# Altium schematic sheet 02 POWER&LED.SchDoc
size A3
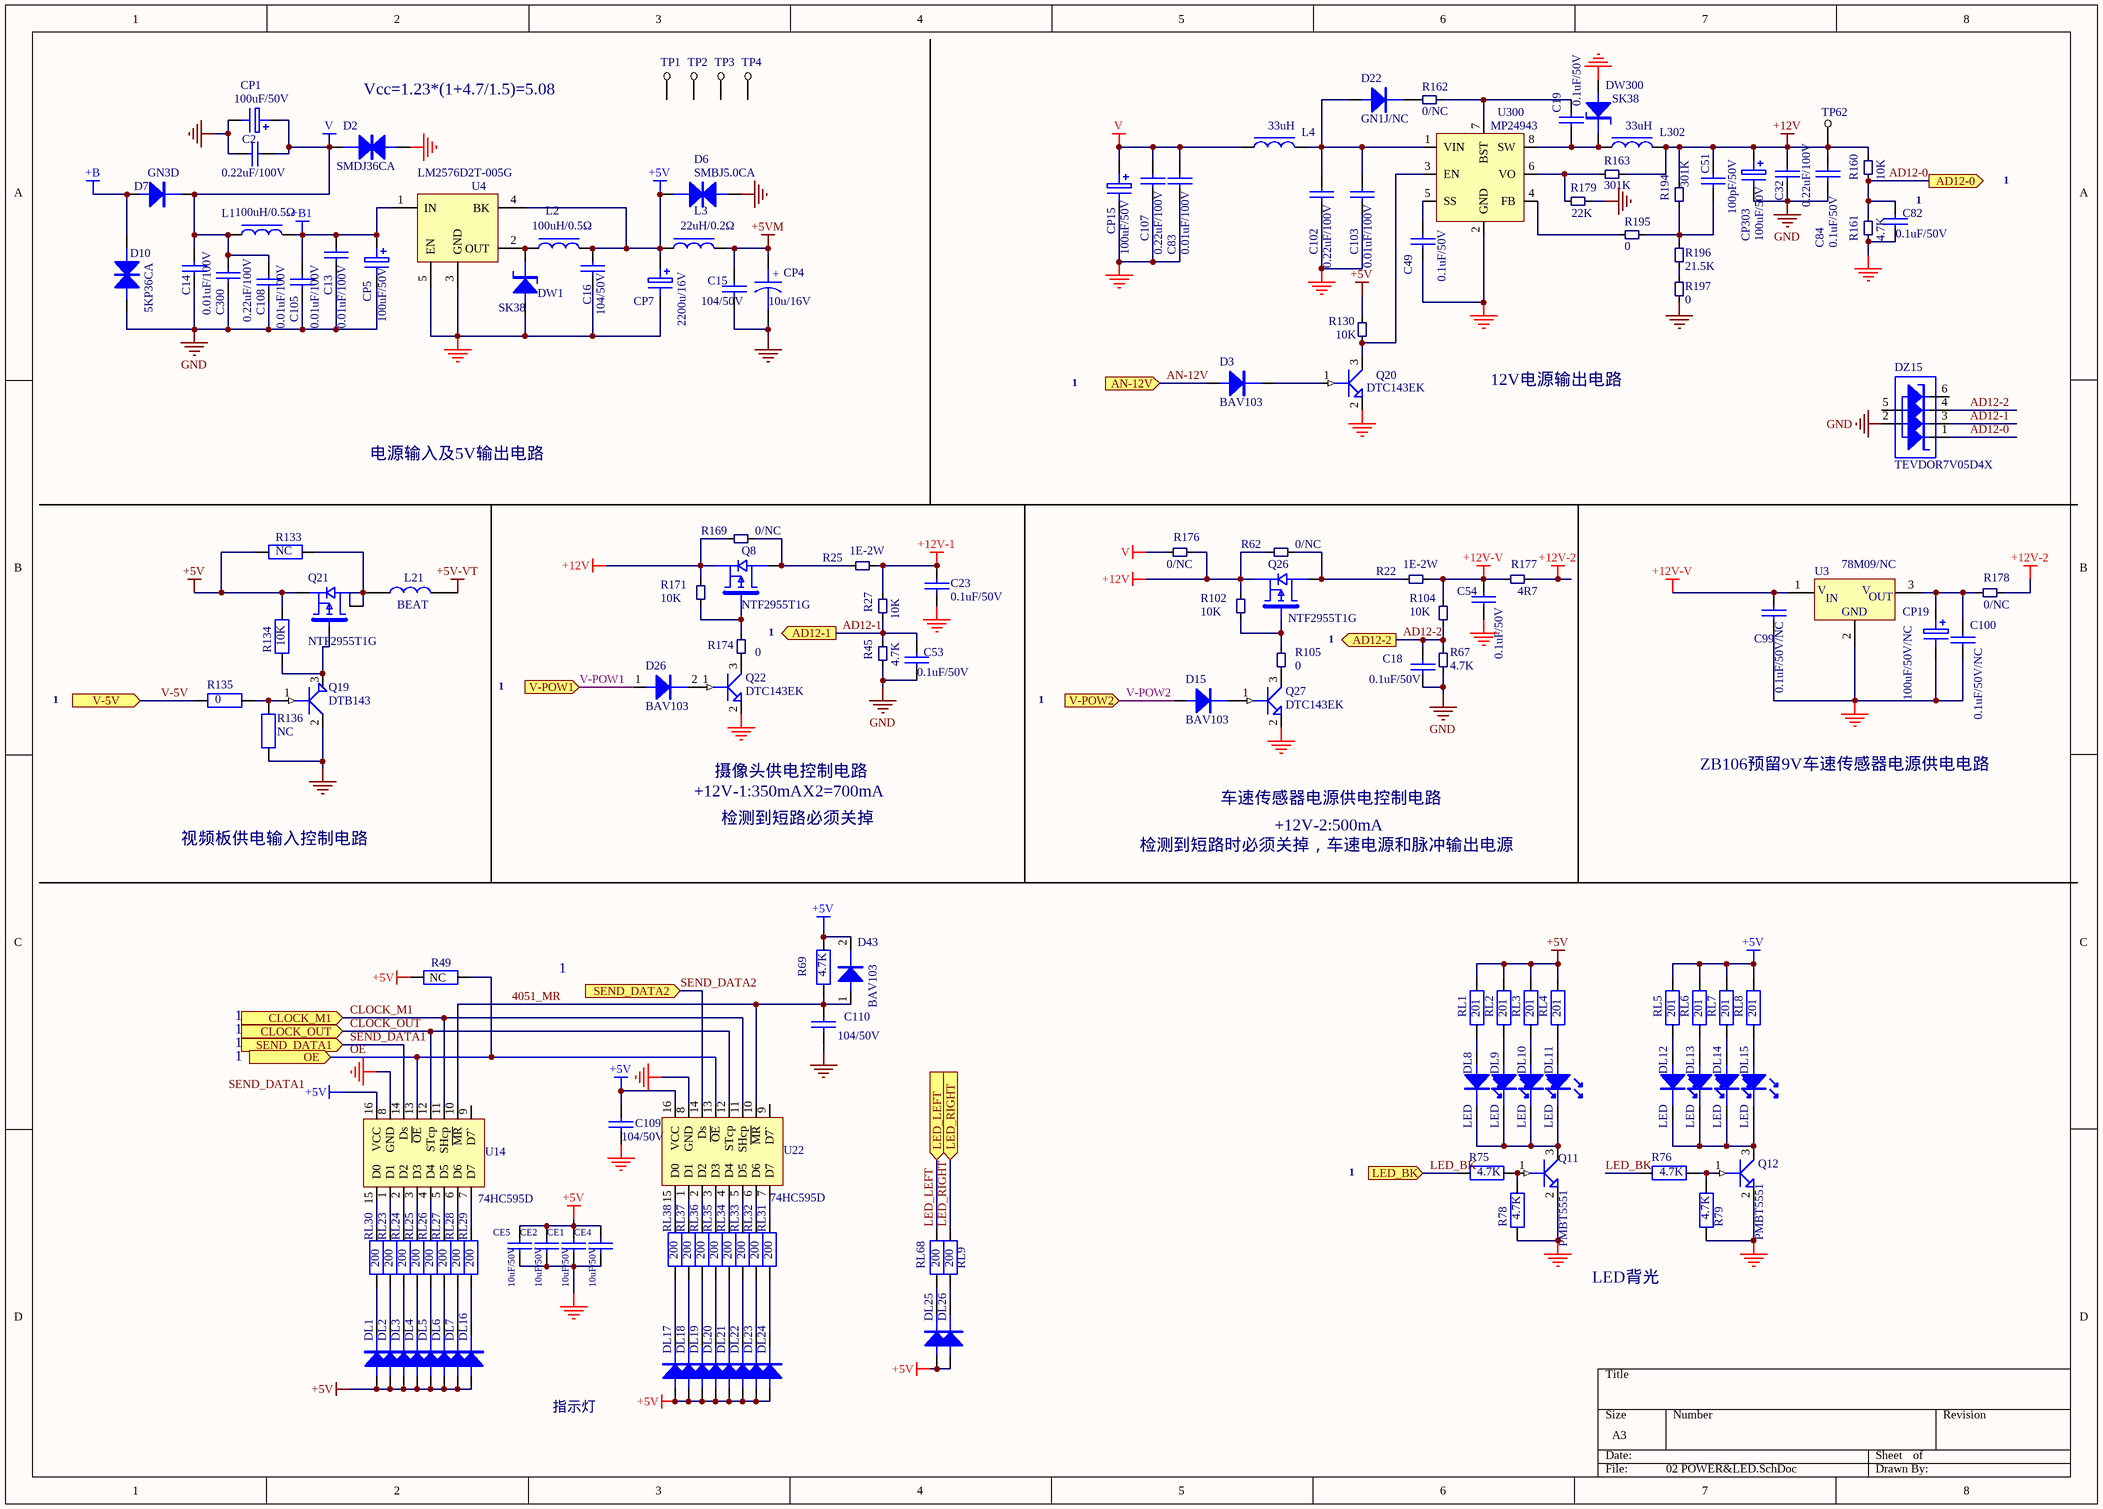
[diagram p0: 02 POWER&LED.SchDoc]

## Parts
C2  0.22uF/100V  [CR1206]
C13  0.01uF/100V  [CR0805]
C14  0.01uF/100V  [CR0805]
C15  104/50V  [CR0805]
C16  104/50V  [CR0805]
C18  0.1uF/50V  [CR0805]
C19  0.1uF/50V  [CR0805]
C23  0.1uF/50V  [CR0805]
C32  0.22uF/100V  [CR1206]
C49  0.1uF/50V  [CR0805]
C51  100pF/50V  [CR0805]
C53  0.1uF/50V  [CR0805]
C54  0.1uF/50V  [CR0805]
C82  0.1uF/50V  [CR0805]
C83  0.01uF/100V  [CR0805]
C84  0.1uF/50V  [CR0805]
C99  0.1uF/50V/NC  [CR0805]
C100  0.1uF/50V/NC  [CR0805]
C102  0.22uF/100V  [CR1206]
C103  0.01uF/100V  [CR0805]
C105  0.01uF/100V  [CR0805]
C107  0.22uF/100V  [CR1206]
C108  0.01uF/100V  [CR0805]
C109  104/50V  [CR0805]
C110  104/50V  [CR0805]
C300  0.22uF/100V  [CR1206]
CE1  10uF/50V  [CR1206]
CE2  10uF/50V  [CR1206]
CE4  10uF/50V  [CR1206]
CE5  10uF/50V  [CR1206]
CP1  100uF/50V  [RB10]
CP4  10u/16V  [CE1206]
CP5  100uF/50V  [RB5-1]
CP7  2200u/16V  [RB12.5]
CP15  100uF/50V  [RB5-1]
CP19  100uF/50V/NC  [RB5-1]
CP303  100uF/50V  [RB5-1]
D2  SMDJ36CA  [SMC-D]
D3  BAV103  [SOD-80C]
D6  SMBJ5.0CA  [SMB-D]
D7  GN3D  [SMC]
D10  5KP36CA  [D-17]
D15  BAV103  [SOD-80C]
D22  GN1J/NC  [SMA]
D26  BAV103  [SOD-80C]
D43  BAV103  [SOD-80C]
DL1  (no value)  [LED1210]
DL2  (no value)  [LED1210]
DL3  (no value)  [LED1210]
DL4  (no value)  [LED1210]
DL5  (no value)  [LED1210]
DL6  (no value)  [LED1210]
DL7  (no value)  [LED1210]
DL8  LED  [LED1210]
DL9  LED  [LED1210]
DL10  LED  [LED1210]
DL11  LED  [LED1210]
DL12  LED  [LED1210]
DL13  LED  [LED1210]
DL14  LED  [LED1210]
DL15  LED  [LED1210]
DL16  (no value)  [LED1210]
DL17  (no value)  [LED1210]
DL18  (no value)  [LED1210]
DL19  (no value)  [LED1210]
DL20  (no value)  [LED1210]
DL21  (no value)  [LED1210]
DL22  (no value)  [LED1210]
DL23  (no value)  [LED1210]
DL24  (no value)  [LED1210]
DL25  (no value)  [LED1210]
DL26  (no value)  [LED1210]
DW1  SK38  [SMC]
DW300  SK38  [SMC]
DZ15  TEVDOR7V05D4X  [SOT-457]
L1  100uH/0.5Ω  [Ind-R13-7-100]
L2  100uH/0.5Ω  [Ind-R13-7-100]
L3  22uH/0.2Ω  [SS0603]
L4  33uH  [Ind-R13-7-100]
L21  BEAT  [CR0805]
L302  33uH  [Ind-R13-7-100]
Q8  NTF2955T1G  [SOT-223]
Q11  PMBT5551  [SOT23]
Q12  PMBT5551  [SOT23]
Q19  DTB143  [SOT23]
Q20  DTC143EK  [SOT23]
Q21  NTF2955T1G  [SOT-223]
Q22  DTC143EK  [SOT23]
Q26  NTF2955T1G  [SOT-223]
Q27  DTC143EK  [SOT23]
R22  1E-2W  [R2512]
R25  1E-2W  [R2512]
R27  10K  [CR0805]
R45  4.7K  [CR0805]
R49  NC  [CR0805]
R62  0/NC  [CR1206]
R67  4.7K  [CR0805]
R69  4.7K  [CR0805]
R75  4.7K  [CR0805]
R76  4.7K  [CR0805]
R78  4.7K  [CR0805]
R79  4.7K  [CR0805]
R102  10K  [CR0805]
R104  10K  [CR0805]
R105  0  [CR0805]
R130  10K  [CR0805]
R133  NC  [CR1206]
R134  10K  [CR0805]
R135  0  [CR0805]
R136  NC  [CR0805]
R160  10K  [CR0805]
R161  4.7K  [CR0805]
R162  0/NC  [CR0805]
R163  301K  [CR0805]
R169  0/NC  [CR1206]
R171  10K  [CR0805]
R174  0  [CR0805]
R176  0/NC  [CR1206]
R177  4R7  [CR1206]
R178  0/NC  [CR1206]
R179  22K  [CR0805]
R194  301K  [CR0805]
R195  0  [CR0805]
R196  21.5K  [CR0805]
R197  0  [CR0805]
RL1  201  [CR0805]
RL2  201  [CR0805]
RL3  201  [CR0805]
RL4  201  [CR0805]
RL5  201  [CR0805]
RL6  201  [CR0805]
RL7  201  [CR0805]
RL8  201  [CR0805]
RL9  200  [CR0805]
RL23  200  [CR0805]
RL24  200  [CR0805]
RL25  200  [CR0805]
RL26  200  [CR0805]
RL27  200  [CR0805]
RL28  200  [CR0805]
RL29  200  [CR0805]
RL30  200  [CR0805]
RL31  200  [CR0805]
RL32  200  [CR0805]
RL33  200  [CR0805]
RL34  200  [CR0805]
RL35  200  [CR0805]
RL36  200  [CR0805]
RL37  200  [CR0805]
RL38  200  [CR0805]
RL68  200  [CR0805]
TP1  TP  [MARK]  (value not drawn)
TP2  TP  [MARK]  (value not drawn)
TP3  TP  [MARK]  (value not drawn)
TP4  TP  [MARK]  (value not drawn)
TP62  (no value)  [TP]
U3  78M09/NC  [DPAK]
U4  LM2576D2T-005G  [SOT-263-5]
U14  74HC595D  [SO-16]
U22  74HC595D  [SO-16]
U300  MP24943  [SOIC8E]

## Ports
AD12-0 (out), AD12-1 (out), AD12-2 (out), AN-12V (in), CLOCK_M1 (in), CLOCK_OUT (in), LED_BK (in), LED_LEFT (in), LED_RIGHT (in), OE (in), SEND_DATA1 (in), SEND_DATA2 (in), V-5V (in), V-POW1 (in), V-POW2 (in)

## Nets
+5V: C16.2 C109.2 CE1.1 CE2.1 CE4.1 CE5.1 CP7.1 D6.1 D43.2(A) DL1.1(A) DL2.1(A) DL3.1(A) DL4.1(A) DL5.1(A) DL6.1(A) DL7.1(A) DL16.1(A) DL17.1(A) DL18.1(A) DL19.1(A) DL20.1(A) DL21.1(A) DL22.1(A) DL23.1(A) DL24.1(A) DL25.1(A) DL26.1(A) L2.2 L3.1 Q21.3(S) R49.1 R69.2 R130.1 R133.1 R134.1 RL1.1 RL2.1 RL3.1 RL4.1 RL5.1 RL6.1 RL7.1 RL8.1 U4.4(BK) U14.16(VCC) U22.16(VCC)
+5V-VT: L21.2
+5VM: C15.1 CP4.1 L3.2
+12V: C32.2 C51.2 C84.2 CP303.1 L302.2 Q8.3 Q26.3 R62.1 R102.2 R160.2 R163.2 R169.1 R171.2 R176.2 R194.1 TP62.1
+12V-1: C23.1 R25.2 R27.2
+12V-2: R177.2 R178.2
+12V-V: C54.1 C99.2 R22.2 R104.2 R177.1 U3.1(VIN)
+B: D7.1(A) D10.1
+B1: C13.2 C105.2 CP5.1 L1.2 U4.1(IN)
GND: C2.1 C13.1 C14.1 C15.2 C16.1 C18.1 C23.2 C32.1 C49.1 C53.1 C54.2 C82.1 C83.1 C84.1 C99.1 C100.2 C102.1 C103.1 C105.1 C107.1 C108.1 C109.1 C110.2 C300.1 CE1.2 CE2.2 CE4.2 CE5.2 CP1.2 CP4.2 CP5.2 CP7.2 CP15.2 CP19.2 CP303.2 D2.2 D6.2 D10.2 DW1.1(A) DW300.1(A) DZ15.2 Q11.2(E) Q12.2(E) Q19.2(c) Q20.2(gnd) Q22.2(gnd) Q27.2(gnd) R45.1 R67.1 R78.2 R79.2 R136.1 R161.1 R179.1 R197.2 U3.2(GND) U4.3(GND) U4.5(EN) U14.8(GND) U22.8(GND) U300.2(GND)
V: C2.2 C14.2 C83.2 C107.2 C108.2 C300.2 CP1.1 CP15.1 D2.1 D7.2(K) L1.1 L4.1 R176.1
4051_MR: C110.1 D43.1(K) R69.1 U14.10(~{MR}) U22.10(~{MR})
AD12-0: C82.2 DZ15.1 R160.1 R161.2 ; port AD12-0
AD12-1: C53.2 DZ15.3 R27.1 R45.2 ; port AD12-1
AD12-2: C18.2 DZ15.4 R67.2 R104.1 ; port AD12-2
AN-12V: D3.1(A) ; port AN-12V
CLOCK_M1: U14.11(SHcp) U22.11(SHcp) ; port CLOCK_M1
CLOCK_OUT: U14.12(STcp) U22.12(STcp) ; port CLOCK_OUT
LED_BK: R75.1 R76.1 ; port LED_BK
LED_LEFT: RL68.1 ; port LED_LEFT
LED_RIGHT: RL9.1 ; port LED_RIGHT
OE: R49.2 U14.13(~{OE}) U22.13(~{OE}) ; port OE
SEND_DATA1: U14.14(Ds) ; port SEND_DATA1
SEND_DATA2: U22.14(Ds) ; port SEND_DATA2
V-5V: R135.1 ; port V-5V
V-POW1: D26.1(A) ; port V-POW1
V-POW2: D15.1(A) ; port V-POW2
NetC19_1: C19.1 DW300.2(K) L302.1 U300.8(SW)
NetC19_2: C19.2 R162.1 U300.7(BST)
NetC49_2: C49.2 U300.5(SS)
NetC51_1: C51.1 R194.2 R195.1 R196.1
NetC100_1: C100.1 CP19.1 R178.1 U3.3(VOUT)
NetC102_2: C102.2 C103.2 D22.1(A) L4.2 U300.1(VIN)
NetD3_2: D3.2(K) Q20.1(in)
NetD15_2: D15.2(K) Q27.1(in)
NetD22_2: D22.2(K) R162.2
NetD26_2: D26.2(K) Q22.1(in)
NetDL1_2: DL1.2(K) RL30.2
NetDL2_2: DL2.2(K) RL23.2
NetDL3_2: DL3.2(K) RL24.2
NetDL4_2: DL4.2(K) RL25.2
NetDL5_2: DL5.2(K) RL26.2
NetDL6_2: DL6.2(K) RL27.2
NetDL7_2: DL7.2(K) RL28.2
NetDL8_1: DL8.1 RL1.2
NetDL8_2: DL8.2 DL9.2 DL10.2 DL11.2 Q11.3(C)
NetDL9_1: DL9.1 RL2.2
NetDL10_1: DL10.1 RL3.2
NetDL11_1: DL11.1 RL4.2
NetDL12_1: DL12.1 RL5.2
NetDL12_2: DL12.2 DL13.2 DL14.2 DL15.2 Q12.3(C)
NetDL13_1: DL13.1 RL6.2
NetDL14_1: DL14.1 RL7.2
NetDL15_1: DL15.1 RL8.2
NetDL16_2: DL16.2(K) RL29.2
NetDL17_2: DL17.2(K) RL38.2
NetDL18_2: DL18.2(K) RL37.2
NetDL19_2: DL19.2(K) RL36.2
NetDL20_2: DL20.2(K) RL35.2
NetDL21_2: DL21.2(K) RL34.2
NetDL22_2: DL22.2(K) RL33.2
NetDL23_2: DL23.2(K) RL32.2
NetDL24_2: DL24.2(K) RL31.2
NetDL25_2: DL25.2(K) RL68.2
NetDL26_2: DL26.2(K) RL9.2
NetDW1_2: DW1.2(K) L2.1 U4.2(OUT)
NetL21_1: L21.1 Q21.2(D) Q21.4(D) R133.2
NetQ8_1: Q8.1 R171.1 R174.1
NetQ8_2: Q8.2 R25.1 R169.2
NetQ11_1: Q11.1(B) R75.2 R78.1
NetQ12_1: Q12.1(B) R76.2 R79.1
NetQ19_1: Q19.1(b) R135.2 R136.2
NetQ19_3: Q19.3(e) Q21.1(G) R134.2
NetQ20_3: Q20.3(out) R130.2 U300.3(EN)
NetQ22_3: Q22.3(out) R174.2
NetQ26_1: Q26.1 R102.1 R105.1
NetQ26_2: Q26.2 R22.1 R62.2
NetQ27_3: Q27.3(out) R105.2
NetR163_1: R163.1 R179.2 U300.6(VO)
NetR195_2: R195.2 U300.4(FB)
NetR196_2: R196.2 R197.1
NetRL23_1: RL23.1 U14.1(D1)
NetRL24_1: RL24.1 U14.2(D2)
NetRL25_1: RL25.1 U14.3(D3)
NetRL26_1: RL26.1 U14.4(D4)
NetRL27_1: RL27.1 U14.5(D5)
NetRL28_1: RL28.1 U14.6(D6)
NetRL29_1: RL29.1 U14.7(D7)
NetRL30_1: RL30.1 U14.15(D0)
NetRL31_1: RL31.1 U22.7(D7)
NetRL32_1: RL32.1 U22.6(D6)
NetRL33_1: RL33.1 U22.5(D5)
NetRL34_1: RL34.1 U22.4(D4)
NetRL35_1: RL35.1 U22.3(D3)
NetRL36_1: RL36.1 U22.2(D2)
NetRL37_1: RL37.1 U22.1(D1)
NetRL38_1: RL38.1 U22.15(D0)

Not connected (* = marked no-connect by the designer): DZ15 5 6; TP1 1; TP2 1; TP3 1; TP4 1; U14 9(D7`); U22 9(D7`)

## Notes on the sheet
- (near D2) Vcc=1.23*(1+4.7/1.5)=5.08
- 1
- (near C82) 1
- 12V电源输出电路
- 电源输入及5V输出电路
- (near Q26) 1
- 摄像头供电控制电路
- ZB106预留9V车速传感器电源供电电路
- 视频板供电输入控制电路
- +12V-1:350mAX2=700mA
- 检测到短路必须关掉
- 检测到短路时必须关掉，车速电源和脉冲输出电源
- 车速传感器电源供电控制电路
- +12V-2:500mA
- LED背光
- 指示灯
- Labels drawn without touching a wire or pin: SEND_DATA1
- (in symbol 78M12) V; IN; OUT
- (in symbol CAPACITOR POL) +

## Library data of the parts
C2 C13-C16 C18 C19 C23 C32 C49 C51 C53 C54 C82-C84 C99 C100 C102 C103 C105 C107-C110 C300 CE1 CE2 CE4 CE5 = CAP: Capacitor
CP1 CP5 CP7 CP15 CP19 CP303 = ELECTRO1: 电解电容
CP4 = CAPACITOR POL: Capacitor
D2 D6 D10 = TVS
D3 D7 D15 D22 D26 D43 = DIODE: 二极管
DL1-DL7 DL16-DL26 = DOS: 贴片二极管
DL8-DL15 = LED: 贴片LED
DW1 DW300 = DW: 稳压二极管
DZ15 = BZA456G: 二极管排
L1 L2 L4 L302 = L: 电感
L3 = L: SS0603220ML
Q8 Q26 = MOS-P: MOS
Q11 Q12 = PMBT5551: PNP   三极管; HelpURL: G:\资料\规格书\二三极管\PMBT5551.pdf
Q19 = BCX53
Q20 Q22 Q27 = DTC143: NPN; HelpURL: G:\资料\规格书\二三极管\dtc143ee.pdf
Q21 = NTF2955T1G: MOS
R22 R25 R27 R45 R62 R67 R102 R104 R105 R130 R160-R163 R169 R171 R174 R176-R179 R194-R197 = Resister mini: 贴片电阻
R49 R69 R75 R76 R78 R79 R133-R136 RL1-RL9 RL23-RL38 RL68 = RES: 贴片电阻
TP62 = TP
U3 = 78M12: IC-三端稳压
U4 = LDO_1: DC/DC
U300 = MP24943: IC-CAN DRIVER; HelpURL: G:\资料\规格书\Freescale\MCP2551.pdf